# EAGLE design lamps (EAGLE 8.5.2)
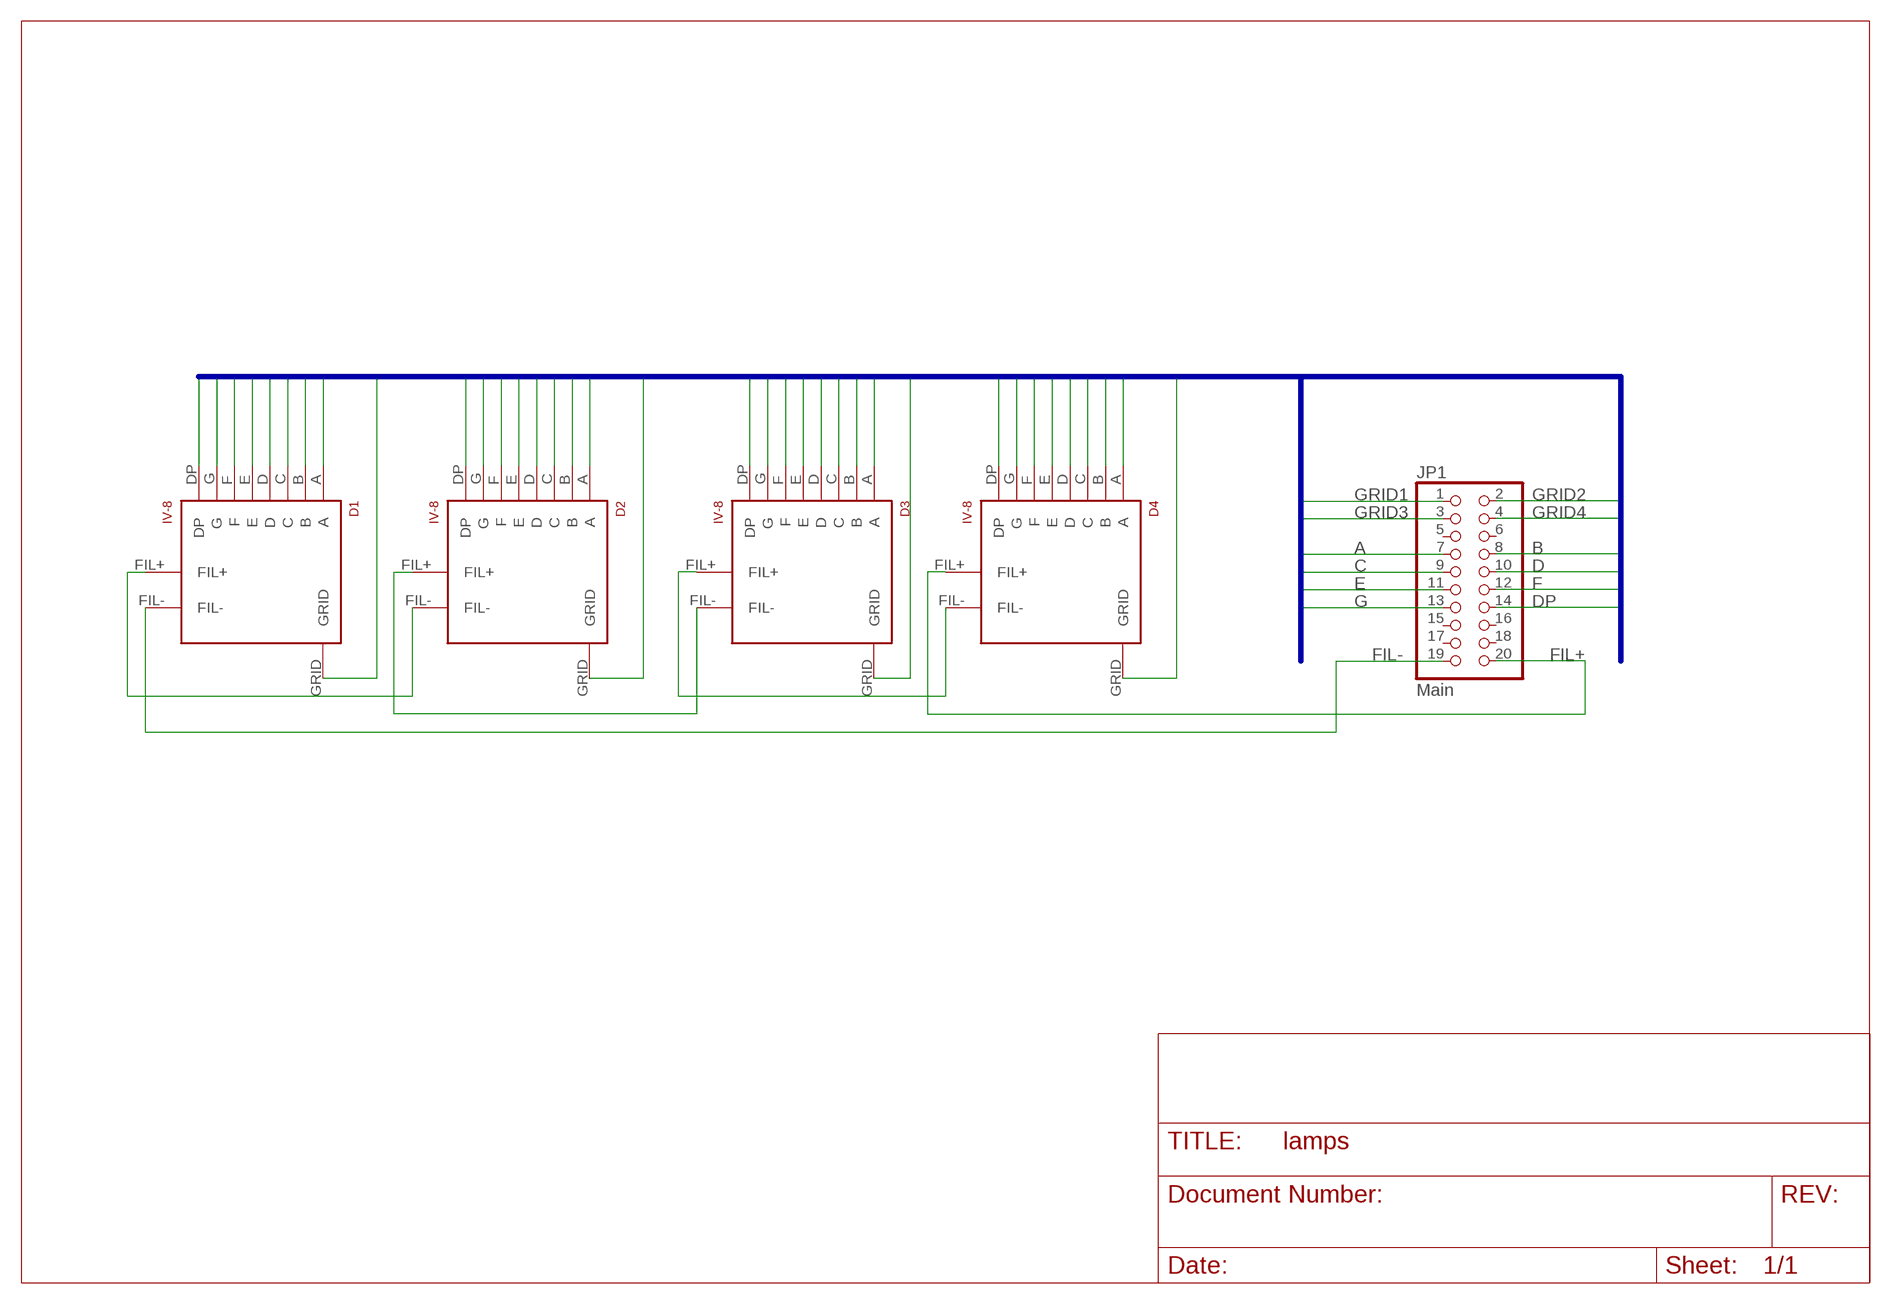
[diagram p0: schematic, sheet 1]

## Parts
D1  IV-8  [IV-8]
D2  IV-8  [IV-8]
D3  IV-8  [IV-8]
D4  IV-8  [IV-8]
JP1  Main  PINHD-2X10  [2X10]

## Nets
A: D1.A D2.A D3.A D4.A JP1.7(A)
B: D1.B D2.B D3.B D4.B JP1.8(B)
C: D1.C D2.C D3.C D4.C JP1.9(C)
D: D1.D D2.D D3.D D4.D JP1.10(D)
DP: D1.DP D2.DP D3.DP D4.DP JP1.14(DP)
E: D1.E D2.E D3.E D4.E JP1.11(E)
F: D1.F D2.F D3.F D4.F JP1.12(F)
FIL+: D4.FIL+ JP1.20(FIL+)
FIL-: D1.FIL- JP1.19(FIL-)
G: D1.G D2.G D3.G D4.G JP1.13(G)
GRID1: D1.GRID JP1.1(GRID1)
GRID2: D2.GRID JP1.2(GRID2)
GRID3: D3.GRID JP1.3(GRID3)
GRID4: D4.GRID JP1.4(GRID4)
N$3: D2.FIL+ D3.FIL-
N$4: D1.FIL+ D2.FIL-
N$5: D3.FIL+ D4.FIL-
Unconnected: JP1.5(GRID5) JP1.6(GRID6) JP1.15 JP1.16 JP1.17 JP1.18

## Buses
DP,A,B,C,D,E,F,G,GRID[1..4]

## Library data of the parts
D1-D4 = russian-vfds:IV-8
JP1 = russian-vfds:PINHD-2X10: PIN HEADER

## Board
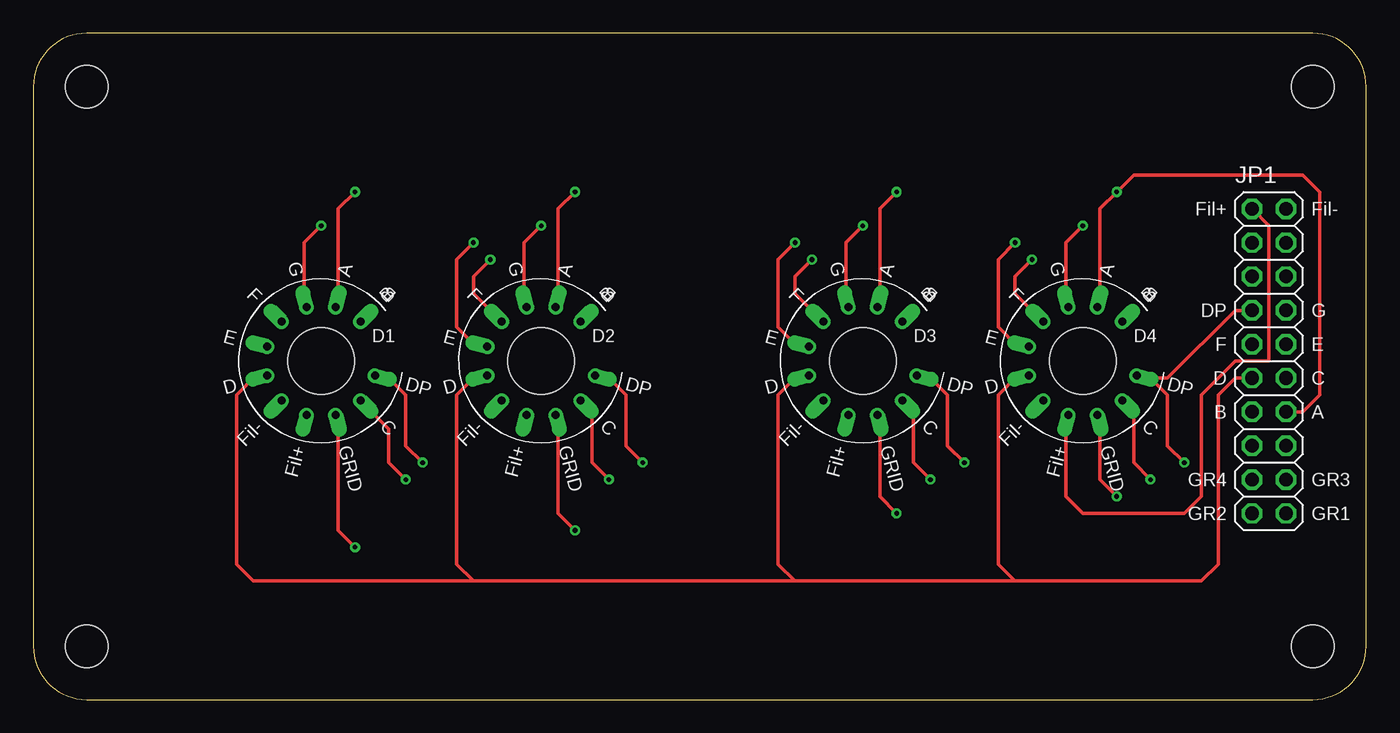
[diagram p1: board, top side]
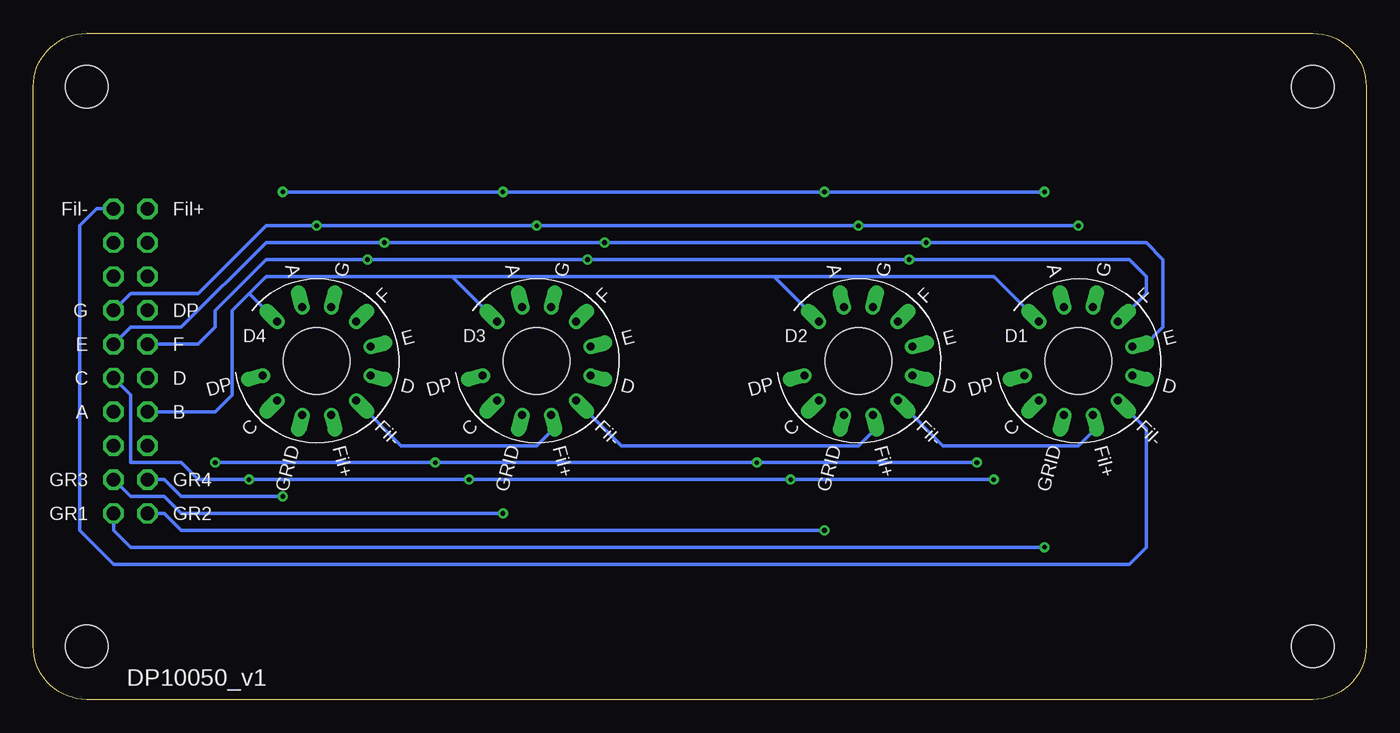
[diagram p2: board, bottom side, seen from below]

Size 100 x 50 mm. Coordinates in mm from the lower left corner, seen from the top.
Copper layers (1*16): Top 0.035mm / dielectric 1.5mm / Bottom 0.035mm
Design rules "default": minimum track width 6mil, minimum drill 0.35mm, track to track 6mil, track to pad 6mil, pad to pad 6mil, via to via 6mil, smd to smd 6mil, copper to edge 40mil, drill to drill 6mil, minimum pad ring 10mil, minimum via ring 8mil, stop-mask expansion 4mil, vias tented up to drill 0mil, thermal gap 10mil

### Footprints (pad centres in the part's own frame; a part is rotated, then mirrored left to right if it is on the bottom)
IV-8 = drill 0.6 offset: A 1.085,4.048; B 2.963,2.963; C 2.963,-2.963; D -4.048,-1.085; DP 4.048,-1.085; E -4.048,1.085; F -2.963,2.963; FIL+ -1.085,-4.048; FIL- -2.963,-2.963; G -1.085,4.048; GRID 1.085,-4.048 | hole 5.004: 0,0
2X10 = drill 1.016 octagon: 1 1.27,-11.43; 2 -1.27,-11.43; 3 1.27,-8.89; 4 -1.27,-8.89; 5 1.27,-6.35; 6 -1.27,-6.35; 7 1.27,-3.81; 8 -1.27,-3.81; 9 1.27,-1.27; 10 -1.27,-1.27; 11 1.27,1.27; 12 -1.27,1.27; 13 1.27,3.81; 14 -1.27,3.81; 15 1.27,6.35; 16 -1.27,6.35; 17 1.27,8.89; 18 -1.27,8.89; 19 1.27,11.43; 20 -1.27,11.43
DP10050_V1 = hole 3.2: 4,4; 96,4; 96,46; 4,46

### Placement (x,y rotation side)
D1  21.59,25.4 0 top
D2  38.1,25.4 0 top
D3  62.23,25.4 0 top
D4  78.74,25.4 0 top
JP1  92.71,25.4 0 top
U$1  [DP10050_V1]  0,0 0 top

### Tracks (layer width: path | path; a pad name or v marks a point on that pad's centre or on a via)
A  (via drill 0.35)
  Top 0.254: v24.13,38.1 22.86,36.83 22.86,30.48 22.68,30.3 D1.A | D4.A 79.83,30.3 80.01,30.48 80.01,36.83 v81.28,38.1 82.55,39.37 95.25,39.37 96.52,38.1 96.52,22.86 95.25,21.59 JP1.7 | D3.A 63.31,30.3 63.5,30.48 63.5,36.83 v64.77,38.1 | D2.A 39.19,30.3 39.37,30.48 39.37,36.83 v40.64,38.1
  Bottom 0.254: v24.13,38.1 v40.64,38.1 v64.77,38.1 v81.28,38.1
B
  Bottom 0.254: 83.82,30.48 D4.B | 83.82,30.48 82.55,31.75 68.58,31.75 | 68.58,31.75 D3.B | 68.58,31.75 44.45,31.75 | 44.45,31.75 D2.B | 44.45,31.75 27.94,31.75 D1.B | JP1.8 86.36,21.59 85.09,22.86 85.09,29.21 83.82,30.48
C  (via drill 0.35)
  Top 0.254: v27.94,16.51 26.67,17.78 26.67,20.32 D1.C | v83.82,16.51 82.55,17.78 82.55,21.59 D4.C | v67.31,16.51 66.04,17.78 66.04,21.59 D3.C | v43.18,16.51 41.91,17.78 41.91,21.59 D2.C
  Bottom 0.254: v27.94,16.51 v43.18,16.51 v67.31,16.51 v83.82,16.51 87.63,16.51 88.9,17.78 92.71,17.78 92.71,22.86 JP1.9
D
  Top 0.254: JP1.10 90.17,24.13 88.9,22.86 88.9,10.16 87.63,8.89 73.66,8.89 | 73.66,8.89 72.39,10.16 72.39,22.86 73.84,24.32 D4.D | 73.66,8.89 57.15,8.89 | 57.15,8.89 55.88,10.16 55.88,22.86 57.34,24.32 D3.D | 57.15,8.89 33.02,8.89 | 33.02,8.89 31.75,10.16 31.75,22.86 33.2,24.32 D2.D | 33.02,8.89 16.51,8.89 15.24,10.16 15.24,22.86 16.7,24.32 D1.D
DP  (via drill 0.35)
  Top 0.254: D2.DP 42.99,24.32 44.45,22.86 44.45,19.05 v45.72,17.78 | D1.DP 26.48,24.32 27.94,22.86 27.94,19.05 v29.21,17.78 | D3.DP 67.12,24.32 68.58,22.86 68.58,19.05 v69.85,17.78 | D4.DP 82.97,24.13 83.82,24.13 | v86.36,17.78 85.09,19.05 85.09,22.86 83.82,24.13 | JP1.14 90.17,29.21 85.09,24.13 83.82,24.13
  Bottom 0.254: v29.21,17.78 v45.72,17.78 v69.85,17.78 v86.36,17.78
E  (via drill 0.35)
  Top 0.254: D4.E 73.84,26.48 72.39,27.94 72.39,33.02 v73.66,34.29 | D3.E 57.34,26.48 55.88,27.94 55.88,33.02 v57.15,34.29 | D2.E 33.2,26.48 31.75,27.94 31.75,33.02 v33.02,34.29
  Bottom 0.254: D1.E 16.7,26.48 15.24,27.94 15.24,33.02 16.51,34.29 v33.02,34.29 v57.15,34.29 v73.66,34.29 82.55,34.29 88.9,27.94 92.71,27.94 JP1.11
F  (via drill 0.35)
  Top 0.254: D4.F 73.66,30.48 73.66,31.75 v74.93,33.02 | v58.42,33.02 57.15,31.75 57.15,30.48 D3.F | v34.29,33.02 33.02,31.75 33.02,30.48 D2.F
  Bottom 0.254: D1.F 16.51,30.48 16.51,31.75 17.78,33.02 v34.29,33.02 v58.42,33.02 v74.93,33.02 82.55,33.02 86.36,29.21 86.36,27.94 87.63,26.67 JP1.12
FIL+
  Top 0.254: D4.FIL+ 77.47,21.17 77.47,15.24 78.74,13.97 86.36,13.97 87.63,15.24 87.63,22.86 90.17,25.4 92.71,25.4 92.71,35.56 JP1.20
FIL-
  Bottom 0.254: JP1.19 95.25,36.83 96.52,35.56 96.52,12.7 93.98,10.16 17.78,10.16 16.51,11.43 16.51,20.32 D1.FIL-
G  (via drill 0.35)
  Top 0.254: D4.G 77.66,30.3 77.47,30.48 77.47,34.29 v78.74,35.56 | D3.G 60.96,29.63 60.96,34.29 v62.23,35.56 | D2.G 36.83,29.63 36.83,34.29 v38.1,35.56 | v21.59,35.56 20.32,34.29 20.32,29.63 D1.G
  Bottom 0.254: v21.59,35.56 v38.1,35.56 v62.23,35.56 v78.74,35.56 82.55,35.56 87.63,30.48 92.71,30.48 JP1.13
GRID1  (via drill 0.35)
  Top 0.254: v24.13,11.43 22.86,12.7 22.86,21.17 D1.GRID
  Bottom 0.254: JP1.1 93.98,12.7 92.71,11.43 v24.13,11.43
GRID2  (via drill 0.35)
  Top 0.254: v40.64,12.7 39.37,13.97 39.37,21.17 D2.GRID
  Bottom 0.254: JP1.2 90.17,13.97 88.9,12.7 v40.64,12.7
GRID3  (via drill 0.35)
  Top 0.254: D3.GRID 63.5,21.17 63.5,15.24 v64.77,13.97
  Bottom 0.254: v64.77,13.97 88.9,13.97 90.17,15.24 92.71,15.24 JP1.3
GRID4  (via drill 0.35)
  Top 0.254: D4.GRID 79.83,20.5 80.01,20.32 80.01,16.51 v81.28,15.24
  Bottom 0.254: v81.28,15.24 88.9,15.24 90.17,16.51 JP1.4
N$3
  Bottom 0.254: D3.FIL- 55.88,19.05 38.1,19.05 36.83,20.32 36.83,21.17 D2.FIL+
N$4
  Bottom 0.254: D2.FIL- 31.75,19.05 21.59,19.05 20.32,20.32 20.32,21.17 D1.FIL+
N$5
  Bottom 0.254: D3.FIL+ 61.15,20.5 60.96,20.32 62.23,19.05 72.39,19.05 D4.FIL-